# EAGLE design atmega32u4bb (EAGLE 6.2)
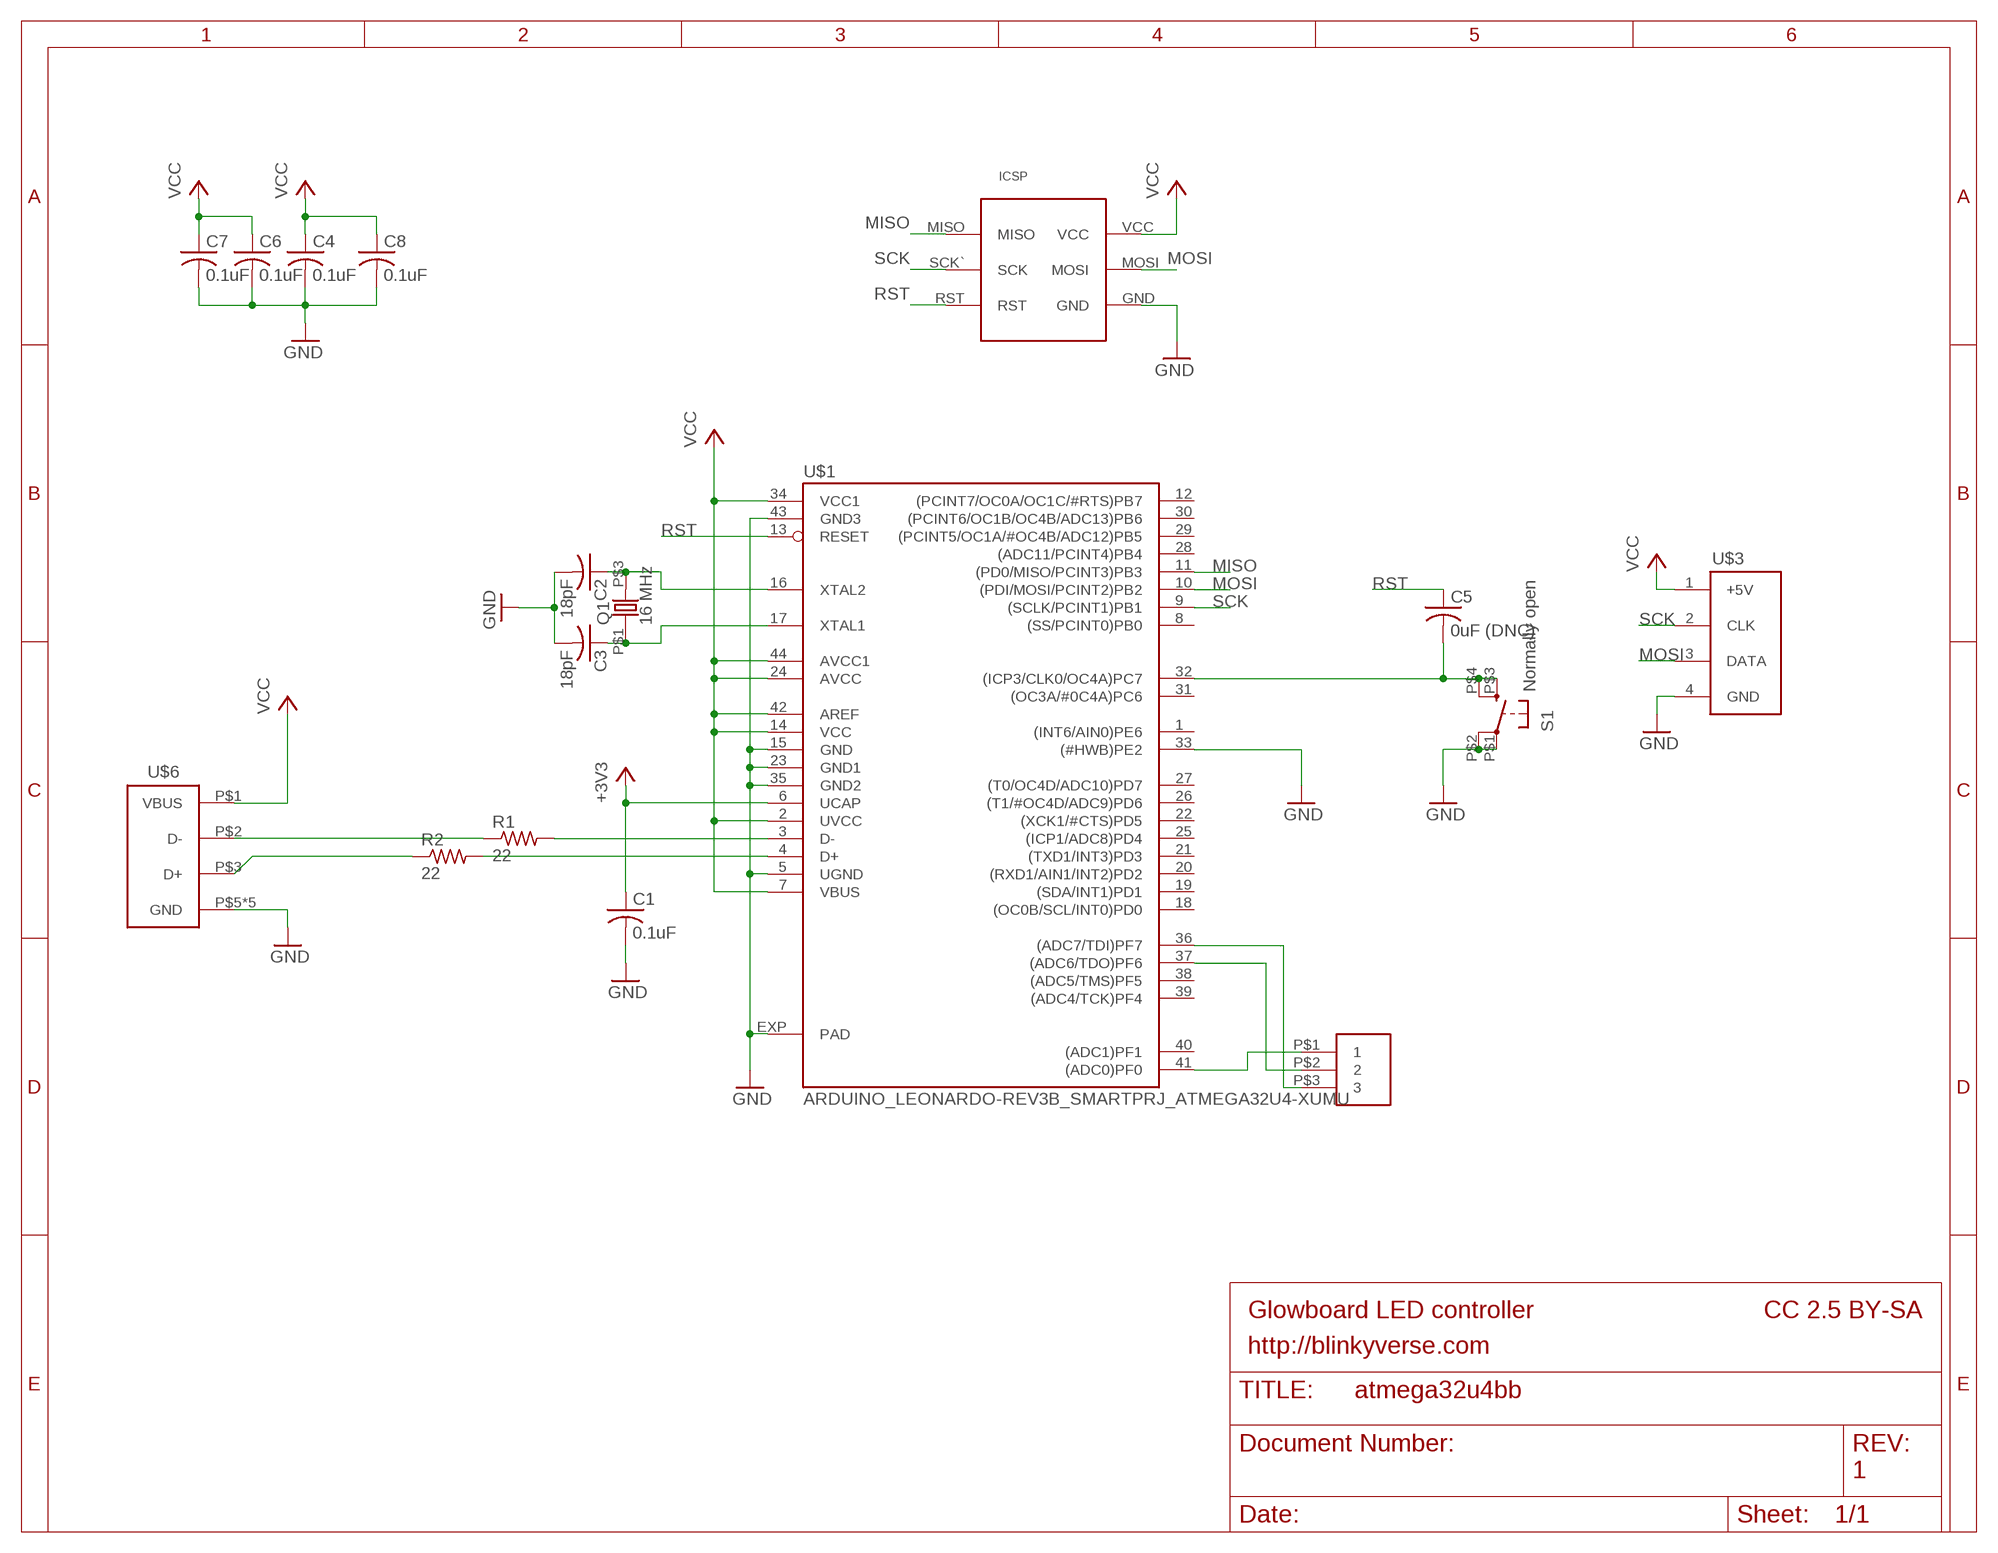
[diagram p0: schematic, sheet 1]

## Parts
C1  0.1uF  C-USC0805K  [C0805K]
C2  18pF  C-USC0805K  [C0805K]
C3  18pF  C-USC0805K  [C0805K]
C4  0.1uF  C-USC0805K  [C0805K]
C5  0uF (DNC)  C-USC0805K  [C0805K]
C6  0.1uF  C-USC0805K  [C0805K]
C7  0.1uF  C-USC0805K  [C0805K]
C8  0.1uF  C-USC0805K  [C0805K]
Q1  16 MHz  ABMM2  [ABMM2_CRYSTAL]
R1  22  R-US_R0805  [R0805]
R2  22  R-US_R0805  [R0805]
S1  Normally open  GLOWBOARD_KMR211G  [GLOWBOARD_KMR211G_SWITCH]
U$1  ARDUINO_LEONARDO-REV3B_SMARTPRJ_ATMEGA32U4-XUMU  [ARDUINO_LEONARDO-REV3B_SMARTPRJ_QFN44ML7X7]
U$3  GLOWBOARD_PAD_CONNECTION  [GLOWBOARD_PAD_CONNECTION]
U$4  GLOWBOARD_ICSP  [GLOWBOARD_ICSP_PADS]
U$5  GLOWBOARD_EXPANSION_HEADER  [GLOWBOARD_EXPANSION_HEADER]
U$6  GLOWBOARD_MINI_USB  [GLOWBOARD_MINI_USB_PADS]

## Nets
+3V3: C1.1 U$1.6(UCAP)
GND: C1.2 C2.2 C3.2 C4.2 C6.2 C7.2 C8.2 S1.P$1(P) S1.P$2(P1) U$1.5(UGND) U$1.15(GND) U$1.23(GND1) U$1.33((#HWB)PE2) U$1.35(GND2) U$1.43(GND3) U$1.EXP(PAD) U$3.4(GND) U$4.GND U$6.P$5(GND) U$6.P$6(GND) U$6.P$7(GND) U$6.P$8(GND) U$6.P$9(GND)
MISO: U$1.11((PD0/MISO/PCINT3)PB3) U$4.MISO
MOSI: U$1.10((PDI/MOSI/PCINT2)PB2) U$3.3(DATA) U$4.MOSI
N$1: U$1.41((ADC0)PF0) U$5.P$1
N$2: R2.1 U$6.P$3(D+)
N$3: R1.2 U$1.3(D-)
N$4: R2.2 U$1.4(D+)
N$5: R1.1 U$6.P$2(D-)
N$6: U$1.37((ADC6/TDO)PF6) U$5.P$2
N$7: U$1.36((ADC7/TDI)PF7) U$5.P$3
N$8: C2.1 Q1.P$3 U$1.16(XTAL2)
N$9: C3.1 Q1.P$1 U$1.17(XTAL1)
N$10: C5.2 S1.P$3(S) S1.P$4(S1) U$1.32((ICP3/CLK0/OC4A)PC7)
RST: C5.1 U$1.13(RESET) U$4.RST
SCK: U$1.9((SCLK/PCINT1)PB1) U$3.2(CLK) U$4.SCK`(SCK)
VCC: C4.1 C6.1 C7.1 C8.1 U$1.2(UVCC) U$1.7(VBUS) U$1.14(VCC) U$1.24(AVCC) U$1.34(VCC1) U$1.42(AREF) U$1.44(AVCC1) U$3.1(+5V) U$4.VCC U$6.P$1(VBUS)
Unconnected: U$1.1((INT6/AIN0)PE6) U$1.8((SS/PCINT0)PB0) U$1.12((PCINT7/OC0A/OC1C/#RTS)PB7) U$1.18((OC0B/SCL/INT0)PD0) U$1.19((SDA/INT1)PD1) U$1.20((RXD1/AIN1/INT2)PD2) U$1.21((TXD1/INT3)PD3) U$1.22((XCK1/#CTS)PD5) U$1.25((ICP1/ADC8)PD4) U$1.26((T1/#OC4D/ADC9)PD6) U$1.27((T0/OC4D/ADC10)PD7) U$1.28((ADC11/PCINT4)PB4) U$1.29((PCINT5/OC1A/#OC4B/ADC12)PB5) U$1.30((PCINT6/OC1B/OC4B/ADC13)PB6) U$1.31((OC3A/#0C4A)PC6) U$1.38((ADC5/TMS)PF5) U$1.39((ADC4/TCK)PF4) U$1.40((ADC1)PF1)

## Notes on the sheet
- Glowboard LED controller | CC 2.5 BY-SA
- http://blinkyverse.com
- 1

## Library data of the parts
C1-C8 = adafruit:C-US: CAPACITOR, American symbol
Q1 = glowboard:ABMM2: CRYSTAL
R1 R2 = adafruit:R-US_: RESISTOR, American symbol
S1 = blinkyboard:GLOWBOARD_KMR211G: KMR211G SWITCH
U$1 = blinkyboard:ARDUINO_LEONARDO-REV3B_SMARTPRJ_ATMEGA32U4-XU
U$3 = blinkyboard:GLOWBOARD_PAD_CONNECTION
U$4 = blinkyboard:GLOWBOARD_ICSP
U$5 = blinkyboard:GLOWBOARD_EXPANSION_HEADER
U$6 = blinkyboard:GLOWBOARD_MINI_USB

## Board
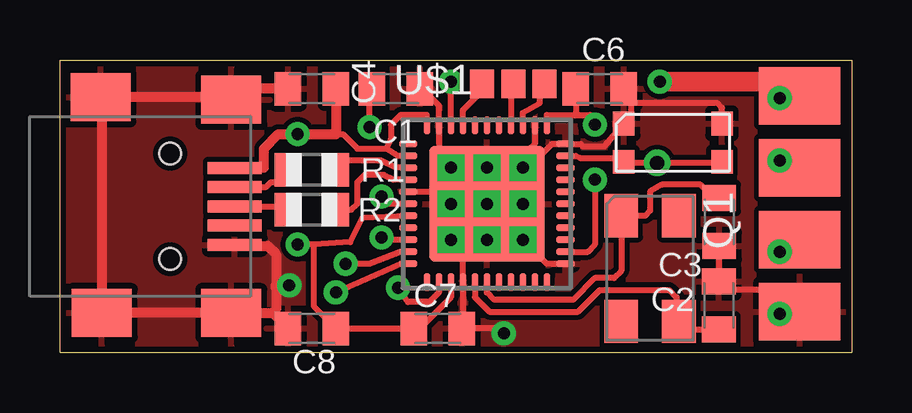
[diagram p1: board, top side]
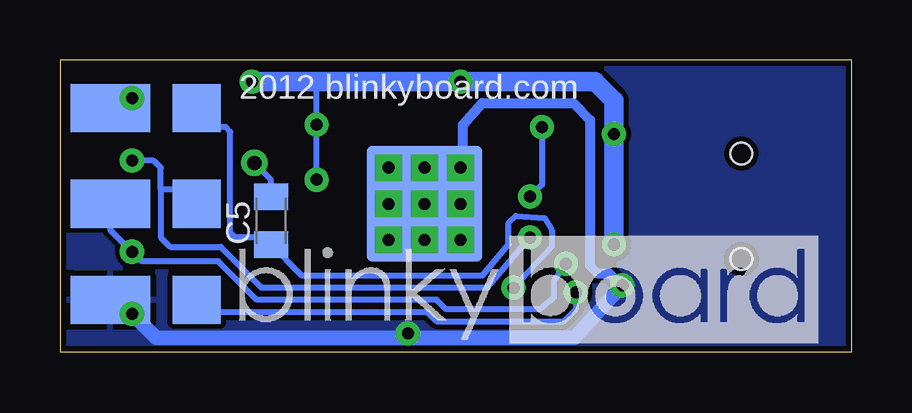
[diagram p2: board, bottom side, seen from below]

Size 33 x 12.2 mm. Coordinates in mm from the lower left corner, seen from the top.
Outline: 0,0 0,12.2 33,12.2 33,0 0,0
Copper layers (1*16): Top 0.035mm / dielectric 1.5mm / Bottom 0.035mm
Design rules: minimum track width 8mil, minimum drill 0.5mm, track to track 8mil, track to pad 8mil, pad to pad 8mil, via to via 8mil, smd to smd 8mil, copper to edge 10mil, drill to drill 8mil, minimum pad ring 12mil, minimum via ring 10mil, stop-mask expansion 4mil, vias tented up to drill 25mil, thermal gap 10mil

### Footprints (pad centres in the part's own frame; a part is rotated, then mirrored left to right if it is on the bottom)
C0805K = smd 1.1 x 1.4: 1 -1,0; 2 1,0
ABMM2_CRYSTAL = smd 1.8 x 1.4: P$1 -2.1,-1.2; P$2 2.3,-1.2; P$3 2.3,1.2; P$4 -2.1,1.2
R0805 = smd 1.1 x 1.4: 1 -1,0; 2 1,0
GLOWBOARD_KMR211G_SWITCH = smd 0.9 x 1: P$1 -2,0.8; P$2 2.1,0.8; P$3 -2,-0.8; P$4 2.1,-0.8
ARDUINO_LEONARDO-REV3B_SMARTPRJ_QFN44ML7X7 = smd 0.75 x 0.275: 1 -3.275,2.5; 2 -3.275,2; 3 -3.275,1.5; 4 -3.275,1; 5 -3.275,0.5; 6 -3.275,0; 7 -3.275,-0.5; 8 -3.275,-1; 9 -3.275,-1.5; 10 -3.275,-2; 11 -3.275,-2.5; 23 3.275,-2.5; 24 3.275,-2; 25 3.275,-1.5; 26 3.275,-1; 27 3.275,-0.5; 28 3.275,0; 29 3.275,0.5; 30 3.275,1; 31 3.275,1.5; 32 3.275,2; 33 3.275,2.5 | smd 0.275 x 0.75: 12 -2.5,-3.275; 13 -2,-3.275; 14 -1.5,-3.275; 15 -1,-3.275; 16 -0.5,-3.275; 17 0,-3.275; 18 0.5,-3.275; 19 1,-3.275; 20 1.5,-3.275; 21 2,-3.275; 22 2.5,-3.275; 34 2.5,3.275; 35 2,3.275; 36 1.5,3.275; 37 1,3.275; 38 0.5,3.275; 39 0,3.275; 40 -0.5,3.275; 41 -1,3.275; 42 -1.5,3.275; 43 -2,3.275; 44 -2.5,3.275 | smd 4.826 x 4.826: EXP 0,0 | smd 4.826 x 4.826 bottom: EXP1 0,0 | drill 0.5 square: P$1 0,0; P$2 -1.5,-1.5; P$3 -1.5,1.5; P$5 1.5,-1.5; P$7 0,-1.5; P$8 -1.5,0; P$12 1.5,0; P$14 0,1.5; P$15 1.5,1.5
GLOWBOARD_PAD_CONNECTION = smd 3.4 x 2.4: 1 0,4.6; 2 0,1.6; 3 0,-1.4; 4 0,-4.4
GLOWBOARD_ICSP_PADS = smd 3.3 x 2 bottom: GND 2,-4; MOSI 2,0; VCC 2,4 | smd 2 x 2 bottom: MISO -1.6,-4; RST -1.6,4; SCK` -1.6,0
GLOWBOARD_EXPANSION_HEADER = smd 1 x 1.2: P$1 -1.3,0; P$2 0,0; P$3 1.3,0
GLOWBOARD_MINI_USB_PADS = smd 0.5 x 2.25: P$1 -0.99,2.99; P$2 -0.19,2.99; P$3 0.61,2.99; P$4 1.41,2.99; P$5 2.21,2.99 | smd 2 x 2.5: P$6 -3.84,2.84; P$7 -3.94,-2.61; P$8 5.06,2.84; P$9 5.06,-2.56 | hole 0.9: -1.59,0.29; 2.81,0.29

### Placement (x,y rotation side)
C1  14,11 0 top
C2  27.47,1.96 90 top
C3  27.49,5.44 270 top
C4  10.5,11 180 top
C5  24.2,5.5 90 bottom
C6  22.5,11 0 top
C7  15.75,1 0 top
C8  10.5,1 180 top
Q1  24.6,3.6 270 top
R1  10.5,7.61 0 top
R2  10.5,5.95 0 top
S1  25.5,8.75 0 top
U$1  17.8,6.2 0 top
U$3  30.84,6.1 0 top
U$4  28.9,6.2 0 top
U$5  18.9,11.2 0 top
U$6  4.3,6.7 270 top

### Tracks (layer width: path | path; a pad name or v marks a point on that pad's centre or on a via)
+3V3  (via drill 0.5)
  Top 0.254: U$1.6 13.7,6.2 v13.4,6.5 | v12.9,9.4 12.9,10.81 C1.1
  Bottom 0.254: 13.3,6.6 v13.4,6.5 12.9,7 v12.9,9.4
GND  (via drill 0.5)
  Top 0.254: U$1.EXP 17.8,5.2 16.8,5.2 U$1.15 16.8,1.1 C7.2 18.32,1 v18.5,0.8 | U$1.5 17.8,6.7 | 17.8,6.7 U$1.EXP | U$1.23 20.3,3.7 U$1.EXP | U$1.EXP 15.8,8.2 U$1.43 15.8,10.3 15.4,10.7 15.4,10.79 C1.2 | C3.2 27.47,4.12 C2.2 27.83,2.6 29.8,2.6 29.8,1.8 v30,1.6 | U$1.35 19.8,8.7 19.65,8.55 | 19.65,8.55 17.8,6.7 | 23.8,10.5 23.5,11.1 C6.2 | 23.8,10.5 23.8,9.6 S1.P$1 22.7,8.6 21.8,8.6 21.7,8.7 U$1.33 20.5,8.7 20,8.2 19.65,8.55 | U$6.P$7 1.74,10.39 | U$6.P$6 6.84,10.64 | S1.P$2 27.6,10.2 27.4,10.4 23.8,10.4 23.8,10.5
  Top 0.406: 1.74,10.39 U$6.P$9 U$6.P$8 8.86,1.64 | 6.84,10.64 U$6.P$7 | U$6.P$5 7.13,4.45 8.65,4.45 9,4.1 9,2.8 | C4.2 7.6,11 U$6.P$6 | 8.86,1.64 C8.2 | 8.86,1.64 9,1.78 9,2.7 9,2.8 | v9.56,2.8 9,2.8
  Top 0.813: U$3.4 30.12,1.62 v30,1.6
  Bottom 0.254: v18.5,0.8 18.1,0.6
  Bottom 0.61: v9.56,2.8 11.56,0.6 18.1,0.6 29,0.6 v30,1.6
  Bottom 0.813: U$4.GND 30.3,1.6 v30,1.6
  pour Top: 0,0 0,12.2 33,12.2 33,0
  pour Bottom: 0,12.2 0,0 33,0 33,12.2
MISO  (via drill 0.5)
  Top 0.254: U$1.11 14.2,3.7 v11.5,2.5
  Bottom 0.254: v11.5,2.5 11.5,1.8 12,1.3 17.3,1.3 17.7,1.7 27.3,1.7 U$4.MISO
MOSI  (via drill 0.5)
  Top 0.254: U$3.3 30.42,4.2 v30,4.2 | U$1.10 14.2,4.2 12.9,3.7 v11.9,3.7
  Bottom 0.254: v11.9,3.7 12.4,3 12.4,2.3 13,1.8 16.9,1.8 17.3,2.2 24.8,2.2 26.4,3.8 29.6,3.8 v30,4.2 30.9,5.1 U$4.MOSI
N$1
  Top 0.254: U$1.41 16.8,10.1 17.6,10.9 U$5.P$1
N$2
  Top 0.254: 9.45,6.05 R2.1 9.54,6.09 U$6.P$3
N$3
  Top 0.254: 11.69,7.61 R1.2 11.99,8 13.4,8 14,7.7 U$1.3
N$4
  Top 0.254: R2.2 12.15,5.95 12.4,6.2 12.4,7.1 12.7,7.4 13.5,7.4 13.9,7.2 U$1.4
N$5
  Top 0.254: R1.1 9.66,7.1 8.8,7.1 8.6,6.9 7.1,6.9 U$6.P$2
N$6
  Top 0.254: U$5.P$2 18.9,11 18.8,10.9 U$1.37
N$7
  Top 0.254: U$1.36 19.3,10 20,10.4 20,11 U$5.P$3
N$8
  Top 0.254: U$1.16 17.3,2.3 17.9,1.7 21.6,1.7 22.5,2.6 25.4,2.6 25.7,2.3 25.7,1.4 Q1.P$3 26.14,0.96 C2.1
N$9
  Top 0.254: C3.1 26.99,6.71 26.7,7 25.1,7 24.6,6.7 24.6,5.9 24.4,5.7 Q1.P$1 23.4,3.4 23.1,3.1 22.3,3.1 21.4,2.2 18.1,2.2 17.8,2.5 U$1.17
N$10  (via drill 0.6)
  Top 0.254: U$1.32 21.5,8.2 21.7,8.1 23.6,8.1 S1.P$3 23.55,7.9 v24.9,7.9 27.5,7.9 S1.P$4
  Bottom 0.254: C5.2 24.2,7.2 v24.9,7.9
N$11
  Bottom 0.406: 16.2,7.7 16.2,9.5 15.4,10.4 11.6,10.4 10.9,9.7 10.9,3.6 10.6,3.3 10.1,3.3 9.6,2.8
RST  (via drill 0.5)
  Top 0.254: U$1.13 15.8,2.5 15.4,2.1 14.5,2.1 v14.1,2.7
  Bottom 0.254: U$4.RST 26.5,9.4 26.1,9.4 25.9,9.2 25.9,5 25.7,4.8 24.6,4.8 C5.1 22.9,3.2 15.4,3.2 14.3,4.5 14.3,5.4 14,5.7 12.8,5.6 12.5,5.1 12.5,4.4 v14.1,2.7
SCK  (via drill 0.5)
  Top 0.254: U$1.9 13.8,4.7 v13.4,4.8 | v30,8 30.08,7.62 U$3.2
  Bottom 0.254: 28.8,6.8 27.9,6.8 U$4.SCK` 26.8,6.5 | v13.4,4.8 15.2,2.7 24.6,2.7 26.3,4.4 28.4,4.4 28.8,4.8 28.8,6.8 | 28.8,6.8 28.8,7.7 29.1,8 v30,8
VCC  (via drill 0.5)
  Top 0.254: U$1.14 16.3,2.3 15,1 C7.1 C8.1 10.6,1.9 10.6,4.5 | U$1.7 12.6,5.6 12.1,4.6 10.6,4.5 | U$1.24 22,4.2 22.3,4.5 v22.3,7.2 | U$1.42 v16.3,11.3 | U$1.34 20.3,9.9 21.6,9.9 | 21.6,9.9 22.1,9.9 v22.3,9.5 | U$1.2 14.1,8.2 13.6,8.5 | 11.5,9.1 11.8,9.1 12.4,8.5 13.6,8.5 | U$1.44 15.3,9.9 14.2,9.9 13.8,9.5 13.8,8.9 13.6,8.5 | C6.1 21.5,10 21.6,9.9 | 10.6,4.5 v9.9,4.5
  Top 0.406: U$6.P$1 8.39,7.69 8.5,7.7 8.5,8.5 9.1,9.1 v9.9,9.1 11.5,9.1 C4.1
  Top 0.813: v25,11.3 29.5,11.3 v30,10.6 30.82,10.6 U$3.1
  Bottom 0.254: 22.3,11.3 v22.3,9.5 v22.3,7.2
  Bottom 0.813: v25,11.3 22.3,11.3 v16.3,11.3 10.7,11.3 9.9,10.5 v9.9,9.1 v9.9,4.5 | U$4.VCC 30.5,10.6 v30,10.6

### Text on the board
bPlace: 2012 blinkyboard.com